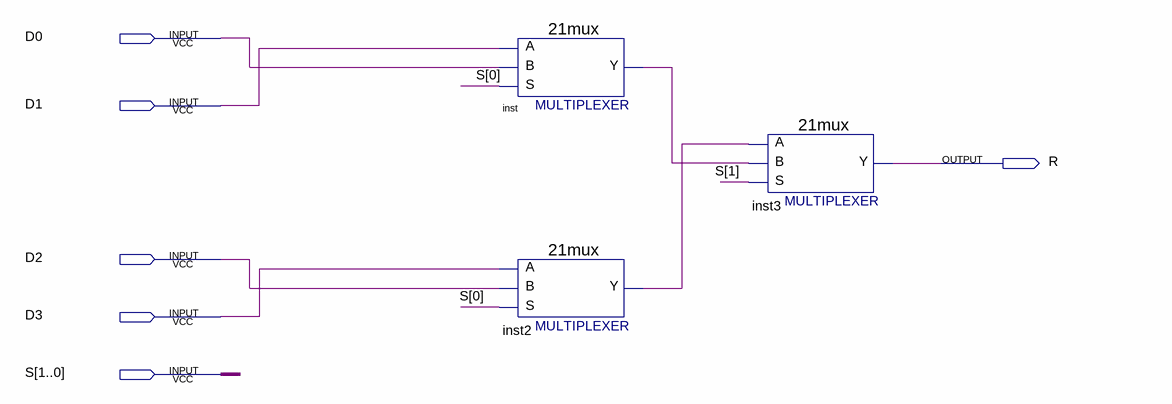
[diagram p0: schematic sheet]
// Quartus schematic mux41.bdf as structural Verilog: 3 symbols, 6 pins
module mux41 (
  input  D0,
  input  D1,
  input  D2,
  input  D3,
  input  [1:0] S,
  output R
);

  wire inst2_y, inst_y;

  \21mux  inst (.S(S[0]), .B(D0), .A(D1), .Y(inst_y));
  \21mux  inst2 (.S(S[0]), .B(D2), .A(D3), .Y(inst2_y));
  \21mux  inst3 (.S(S[1]), .B(inst_y), .A(inst2_y), .Y(R));
endmodule
